# Altium schematic sheet Bridge.SchDoc
size A4
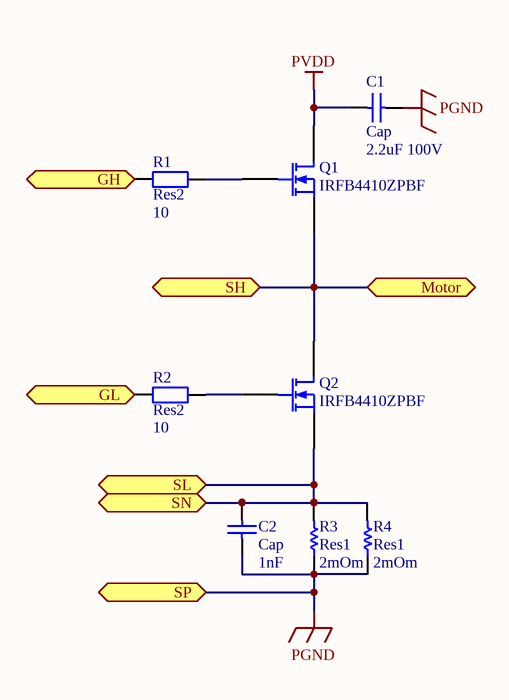
[diagram p0: Bridge.SchDoc]

## Parts
C1  Cap  value 2.2uF 100V  [RAD-0.3]
C2  Cap  value 1nF  [RAD-0.3]
Q1  IRFB4410ZPBF  [TO-220AB]
Q2  IRFB4410ZPBF  [TO-220AB]
R1  Res2  value 10  [6-0805_N]
R2  Res2  value 10  [6-0805_N]
R3  Res1  value 2mOm  [AXIAL-0.3]
R4  Res1  value 2mOm  [AXIAL-0.3]

## Ports
GH, GL, Motor, SH, SL, SN, SP

## Nets
PGND: C1.1 C2.1 R3.1 R4.1 ; port SP
PVDD: C1.2 Q1.1(D)
GH: R1.1 ; port GH
GL: R2.1 ; port GL
Motor: Q1.3(S) Q2.1(D) ; port SH, port Motor
SL: C2.2 Q2.3(S) R3.2 R4.2 ; port SL, port SN
NetQ1_2: Q1.2(G) R1.2
NetQ2_2: Q2.2(G) R2.2

## Library data of the parts
C1 C2 = Cap: Capacitor; Published: 8-Jun-2000; LatestRevisionDate: 17-Jul-2002; LatestRevisionNote: Re-released for DXP Platform.; PackageReference: RAD-0.3; Publisher: Altium Limited; PackageDescription: Radial Cap, Thru-Hole; 2 Leads; 0.3 in Pin Spacing
Q1 Q2 = MOSFET-N: Published: 8-Jun-2000; LatestRevisionDate: 17-Jul-2002; LatestRevisionNote: Re-released for DXP Platform.; PackageVersion: 1995/1996; PackageReference: E3; Publisher: Altium Limited; PackageDescription: TO, Flat Index; 3 In-Line, Axial Leads; Body Dia. 4.6mm; Lead Dia. 0.5 mm (max)
R1 R2 = Res2: Resistor; Published: 8-Jun-2000; LatestRevisionDate: 17-Jul-2002; LatestRevisionNote: Re-released for DXP Platform.; PackageReference: AXIAL-0.4; Publisher: Altium Limited; PackageDescription: Axial Device, Thru-Hole; 2 Leads; 0.4 in Pin Spacing
R3 R4 = Res1: Resistor; Published: 8-Jun-2000; LatestRevisionDate: 17-Jul-2002; LatestRevisionNote: Re-released for DXP Platform.; PackageReference: AXIAL-0.3; Publisher: Altium Limited; PackageDescription: Axial Device, Thru-Hole; 2 Leads; 0.3 in Pin Spacing